# EasyEDA schematic 1-Schematic_EmbeddedLab.json
TITLE: Atmega circuit; REV: 1.0; Date: 2023-10-31; Sheet: 1/1; Drawn By: resuliklevis; Company: TTK4155
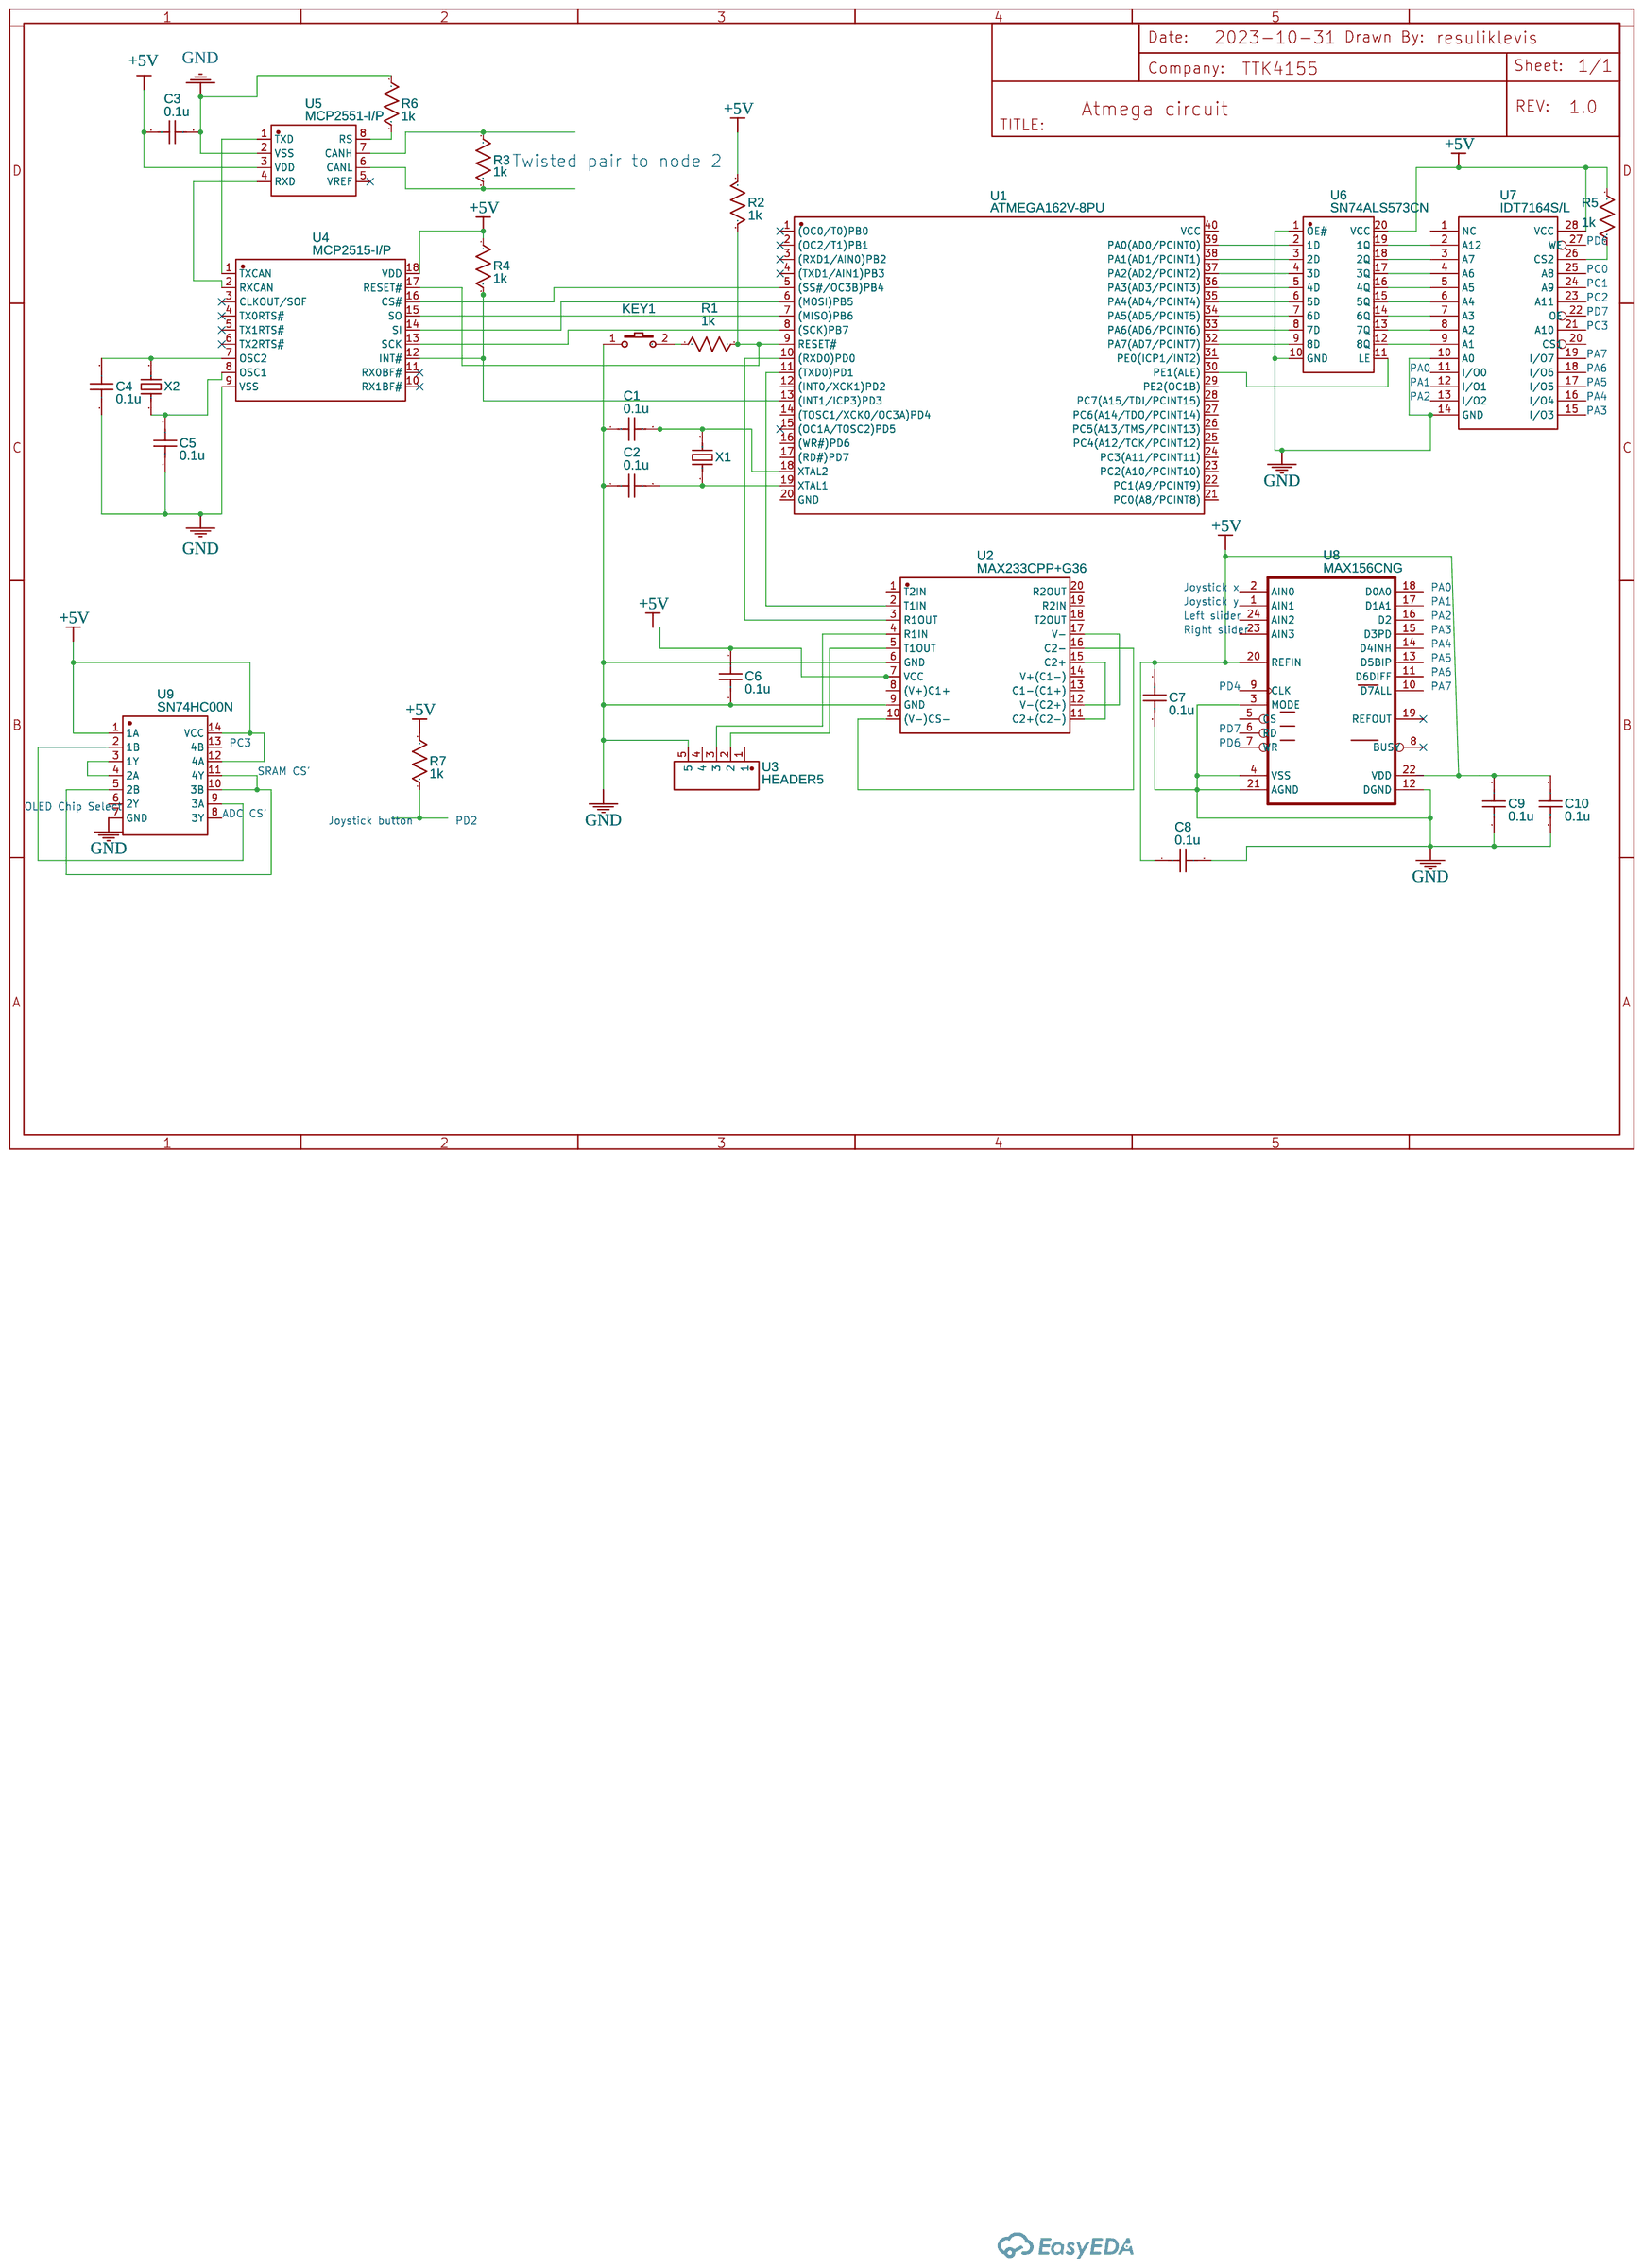
[diagram p0: schematic sheet]

## Parts
C1  0.1u  [C0603]
C2  0.1u  [C0603]
C3  0.1u  [C0603]
C4  0.1u  [C0603]
C5  0.1u  [C0603]
C6  0.1u  [C0603]
C7  0.1u  [C0603]
C8  0.1u  [C0603]
C9  0.1u  [C0603]
C10  0.1u  [C0603]
KEY1  K2-3.6×6.1_SMD  [KEY-SMD_2P-L6.2-W3.6-LS8.0]
R1  1k  [R0603]
R2  1k  [R0603]
R3  1k  [R0603]
R4  1k  [R0603]
R5  1k  [R0603]
R6  1k  [R0603]
R7  1k  [R0603]
U1  ATMEGA162V-8PU  [PDIP-40_L52.3-W13.7-P2.54-LS15.5-BL]
U2  MAX233CPP+G36  [PDIP-20_L26.2-W7.6-P2.54-LS7.9-BL]
U3  HEADER5  [CONN-TH_HEADER5]
U4  MCP2515-I/P  [PDIP-18_L22.9-W6.4-P2.54-LS7.9-BL]
U5  MCP2551-I/P  [PDIP-8_L9.3-W6.4-P2.54-LS7.6-BL]
U6  SN74ALS573CN  [PDIP-20_L25.9-W6.6-P2.54-LS7.9-BL]
U7  IDT7164S/L  [DIP28-300 SOCKET COPY]
U8  MAX156CNG  [DIL24-3]
U9  SN74HC00N  [SN74HC00N]
X1  SMD-2_5032-48M  [CRYSTAL-SMD_L5.0-W3.2]
X2  SMD-2_5032-48M  [CRYSTAL-SMD_L5.0-W3.2]

## Library data of the parts
C1-C10 = C_0603_US: Contributor: LCEDA_Lib
KEY1 = K2-3.6×6.1_SMD: Supplier Part: C118141; Supplier: LCSC; Manufacturer Part: K2-1107ST-A4SW-06; Contributor: LCEDA_Lib; 制造商: 韩国韩荣
R1-R7 = R_0603_US: Contributor: LCEDA_Lib
U1 = ATMEGA162V-8PU: Contributor: lcsc; Supplier: LCSC; Supplier Part: C1340562; Manufacturer: MICROCHIP(美国微芯); JLCPCB Part Class: Extended Part; link: https://lcsc.com/eda_search?q=C1340562&%26type=1&ref=editor
U2 = MAX233CPP+G36: Contributor: lcsc; Supplier: LCSC; Supplier Part: C2832374; Manufacturer: MAXIM(美信); link: https://lcsc.com/eda_search?q=C2832374&%26type=1&ref=editor
U3 = HEADER5: Contributor: LCSC; Supplier: LCSC; Supplier Part: C9900003337; Manufacturer: null; Manufacturer Part: Header5; JLCPCB Part Class: Extended Part; link: https://lcsc.com/eda_search?q=C9900003337&%26type=1&ref=editor
U4 = MCP2515-I/P: Contributor: lcsc; Supplier: LCSC; Supplier Part: C469036; Manufacturer: MICROCHIP(美国微芯); JLCPCB Part Class: Extended Part; link: https://lcsc.com/eda_search?q=C469036&%26type=1&ref=editor
U5 = MCP2551-I/P: Contributor: LCSC; Supplier: LCSC; Supplier Part: C411627; Manufacturer: MICROCHIP(美国微芯); JLCPCB Part Class: Extended Part; link: https://lcsc.com/eda_search?q=C411627&%26type=1&ref=editor
U6 = SN74ALS573CN: Contributor: LCSC; Supplier: LCSC; Supplier Part: C1547827; Manufacturer: TI(德州仪器); JLCPCB Part Class: Extended Part; link: https://lcsc.com/eda_search?q=C1547827&%26type=1&ref=editor
U7 = IDT7164S/L: Contributor: experienced
U8 = MAX156CNG: ANALOGDIGITAL CONVERTER
U9 = SN74HC00N: Supplier: Scot-thai; Manufacturer: TI; image: //image.lceda.cn/szlcsc/C2902.jpg; Supplier Part: C2902; Contributor: Aemy zZoy
X1 X2 = SMD-2_5032-48M: Contributor: LCSC; Supplier: LCSC; Supplier Part: C9900008869; Manufacturer: null; JLCPCB Part Class: Extended Part; link: https://lcsc.com/eda_search?q=C9900008869&%26type=1&ref=editor

## Nets
+5V: C3.1 C7.1 C8.1 C9.2 C10.1 R2.2 R4.1 R5.1 R7.2 U4.18(VDD) U5.3(VDD) U6.20(VCC) U7.28(VCC) U8.20(REFIN) U8.22(VDD) U9.1(1A) U9.12(4A) U9.14(VCC)
GND: C1.1 C2.1 C3.2 C4.1 C5.1 C6.2 C7.2 C8.2 C9.1 C10.2 KEY1.1 R6.1 U2.6(GND) U2.9(GND) U3.5 U4.9(VSS) U5.2(VSS) U6.1(OE#) U6.10(GND) U7.10(A0) U7.14(GND) U8.3(MODE) U8.4(VSS) U8.12(DGND) U8.21(AGND) U9.7(GND)
Net-(C1-2): C1.2 U1.18(XTAL2) X1.1
Net-(C2-2): C2.2 U1.19(XTAL1) X1.2
Net-(C4-2): C4.2 U4.7(OSC2) X2.1
Net-(C5-2): C5.2 U4.8(OSC1) X2.2
Net-(C6-1): C6.1 U2.7(VCC)
Net-(KEY1-2): KEY1.2 R1.1
Net-(R1-2): R1.2 R2.1 U1.9(RESET#) U4.17(RESET#)
Net-(R3-1): R3.1 U5.7(CANH)
Net-(R3-2): R3.2 U5.6(CANL)
Net-(R4-2): R4.2 U1.13((INT1/ICP3)PD3) U4.12(INT#)
Net-(R5-2): R5.2 U7.26(CS2)
Net-(R6-2): R6.2 U5.8(RS)
Net-(U1-5): U1.5((SS#/OC3B)PB4) U4.16(CS#)
Net-(U1-6): U1.6((MOSI)PB5) U4.14(SI)
Net-(U1-7): U1.7((MISO)PB6) U4.15(SO)
Net-(U1-8): U1.8((SCK)PB7) U4.13(SCK)
Net-(U1-10): U1.10((RXD0)PD0) U2.3(R1OUT)
Net-(U1-11): U1.11((TXD0)PD1) U2.2(T1IN)
Net-(U1-30): U1.30(PE1(ALE)) U6.11(LE)
Net-(U1-32): U1.32(PA7(AD7/PCINT7)) U6.9(8D)
Net-(U1-33): U1.33(PA6(AD6/PCINT6)) U6.8(7D)
Net-(U1-34): U1.34(PA5(AD5/PCINT5)) U6.7(6D)
Net-(U1-35): U1.35(PA4(AD4/PCINT4)) U6.6(5D)
Net-(U1-36): U1.36(PA3(AD3/PCINT3)) U6.5(4D)
Net-(U1-37): U1.37(PA2(AD2/PCINT2)) U6.4(3D)
Net-(U1-38): U1.38(PA1(AD1/PCINT1)) U6.3(2D)
Net-(U1-39): U1.39(PA0(AD0/PCINT0)) U6.2(1D)
Net-(U2-4): U2.4(R1IN) U3.3
Net-(U2-5): U2.5(T1OUT) U3.2
Net-(U2-10): U2.10((V-)CS-) U2.16(C2-)
Net-(U2-11): U2.11(C2+(C2-)) U2.15(C2+)
Net-(U2-12): U2.12(V-(C2+)) U2.17(V-)
Net-(U4-1): U4.1(TXCAN) U5.1(TXD)
Net-(U4-2): U4.2(RXCAN) U5.4(RXD)
Net-(U6-12): U6.12(8Q) U7.9(A1)
Net-(U6-13): U6.13(7Q) U7.8(A2)
Net-(U6-14): U6.14(6Q) U7.7(A3)
Net-(U6-15): U6.15(5Q) U7.6(A4)
Net-(U6-16): U6.16(4Q) U7.5(A5)
Net-(U6-17): U6.17(3Q) U7.4(A6)
Net-(U6-18): U6.18(2Q) U7.3(A7)
Net-(U6-19): U6.19(1Q) U7.2(A12)
Net-(U9-2): U9.2(1B) U9.9(3A)
Net-(U9-3): U9.3(1Y) U9.4(2A)
Net-(U9-5): U9.5(2B) U9.10(3B) U9.11(4Y)

Not connected (* = marked no-connect by the designer): R7 1; U1 1((OC0/T0)PB0)* 2((OC2/T1)PB1)* 3((RXD1/AIN0)PB2)* 4((TXD1/AIN1)PB3)* 12((INT0/XCK1)PD2) 14((TOSC1/XCK0/OC3A)PD4) 15((OC1A/TOSC2)PD5)* 16((WR#)PD6) 17((RD#)PD7) 20(GND) 21(PC0(A8/PCINT8)) 22(PC1(A9/PCINT9)) 23(PC2(A10/PCINT10)) 24(PC3(A11/PCINT11)) 25(PC4(A12/TCK/PCINT12)) 26(PC5(A13/TMS/PCINT13)) 27(PC6(A14/TDO/PCINT14)) 28(PC7(A15/TDI/PCINT15)) 29(PE2(OC1B)) 31(PE0(ICP1/INT2)) 40(VCC); U2 1(T2IN) 8((V+)C1+) 13(C1-(C1+)) 14(V+(C1-)) 18(T2OUT) 19(R2IN) 20(R2OUT); U3 1 4; U4 3(CLKOUT/SOF)* 4(TX0RTS#)* 5(TX1RTS#)* 6(TX2RTS#)* 10(RX1BF#)* 11(RX0BF#)*; U5 5(VREF)*; U7 1(NC) 11(I/O0) 12(I/O1) 13(I/O2) 15(I/O3) 16(I/O4) 17(I/O5) 18(I/O6) 19(I/O7) 20(CS1) 21(A10) 22(OE) 23(A11) 24(A9) 25(A8) 27(WE); U8 1(AIN1) 2(AIN0) 5(CS) 6(RD) 7(WR) 8(BUSY)* 9(CLK) 10(D7ALL) 11(D6DIFF) 13(D5BIP) 14(D4INH) 15(D3PD) 16(D2) 17(D1A1) 18(D0A0) 19(REFOUT)* 23(AIN3) 24(AIN2); U9 6(2Y) 8(3Y) 13(4B)

## Notes on the sheet
- Twisted pair to node 2
- PD6
- PC0
- PC1
- PC2
- PD7
- PC3
- PA7
- PA0
- PA1
- PA5
- PA6
- PA2
- PA4
- PA3
- Joystick x
- PA0
- Joystick y
- Left slider
- PA1
- PA2
- Right slider
- PA3
- PA4
- PA5
- PA6
- PD4
- PA7
- PD7
- PC3
- PD6
- SRAM CS'
- OLED Chip Select
- ADC CS'
- Joystick button
- PD2
